# Altium project Power Supply.PrjPcb (part 3 of 3)
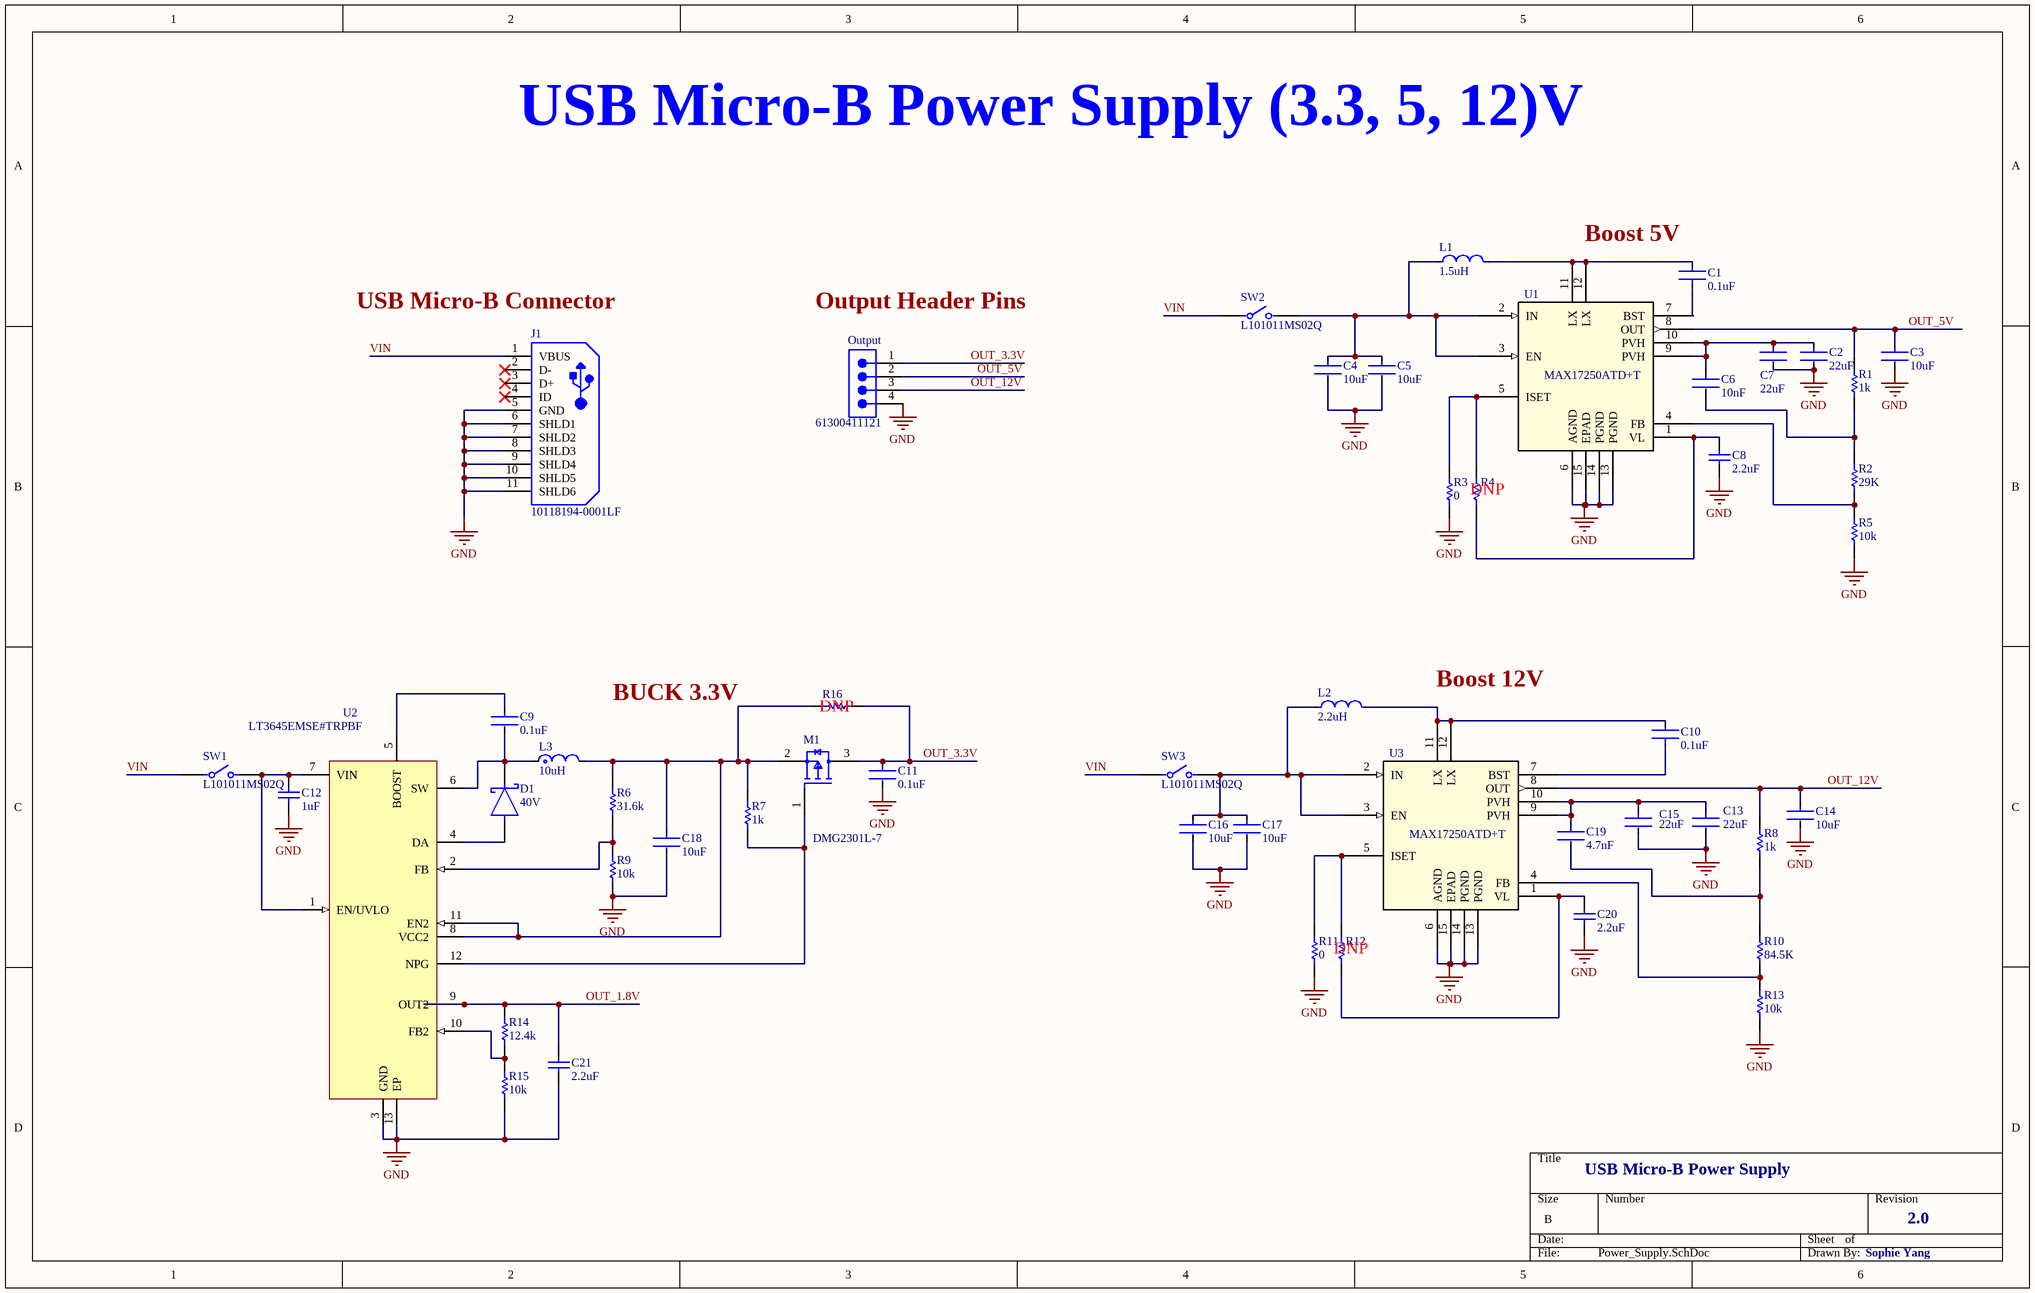
[diagram p2: Power_Supply.SchDoc]

## Sheet Power_Supply.SchDoc (continued)

### Library data of the parts (continued)
R10 = CRCW080584K5FKEA: RES SMD 84.5K OHM 1% 1/8W 0805; Manufacturer: Vishay; Power: 125mW; Rated Temperature: 70°C; Value: 84.5kR; Working Voltage: 150V; Temperature Coefficient (ppm/Cel): 100; Package Height: 0.45mm; Package Length: 2mm; Package Width: 1.25mm; Reference Standard: AEC-Q200; Supplier: Digikey; Supplier Part Number: 541-84.5KCCT-ND; Manufacturer Part Number: CRCW080584K5FKEA; RoHS: Yes; Category: Chip SMD Resistors; Stock: 69341; Pricing: 1=0.1, 10=0.041, 100=0.0212, 1000=0.01254, 2500=0.01059 (USD); Mounting Technology: Surface Mount; Pins: 2; Package Shape: Rectangular; Case/Package: 0805; Terminal Finish: Nickel; Min Operating Temperature: -55°C; Max Operating Temperature: 155°C; Tolerance: 1%; JESD-609 Code: e3; Resistor Type: FIXED RESISTOR; Construction: Chip; Packaging: Tape and Reel; Technology: METAL GLAZE/THICK FILM; Termination: Wraparound; Reach SVHC Compliant: Yes; RoHS Compliant: Yes; ComponentLink1URL: https://datasheet.ciiva.com:443/pdfs/VipMasterIC/IC/VISH/VISH-S-A0007266705/VISH-S-A0007266705-1.pdf?src-supplier=IHS+Markit; ComponentLink1Description: https://datasheet.ciiva.com:443/pdfs/VipMasterIC/IC/VISH/VISH-S-A0007266705/VISH-S-A0007266705-1.pdf?src-supplier=IHS+Markit; ComponentLink2URL: https://datasheet.ciiva.com/7816/1533075-7816217.pdf?src-supplier=Element14; ComponentLink2Description: https://datasheet.ciiva.com/7816/1533075-7816217.pdf?src-supplier=Element14; ComponentLink3URL: https://datasheet.ciiva.com/2495/dcrcwe3-2495959.pdf?src-supplier=Digikey; ComponentLink3Description: https://datasheet.ciiva.com/2495/dcrcwe3-2495959.pdf?src-supplier=Digikey; ComponentLink4URL: https://datasheet.ciiva.com/2495/dcrcwe3-2495960.pdf?src-supplier=Digikey; ComponentLink4Description: https://datasheet.ciiva.com/2495/dcrcwe3-2495960.pdf?src-supplier=Digikey; ComponentLink5URL: https://datasheet.ciiva.com/2495/dcrcwe3-2495961.pdf?src-supplier=Digikey; ComponentLink5Description: https://datasheet.ciiva.com/2495/dcrcwe3-2495961.pdf?src-supplier=Digikey; ComponentLink6URL: https://datasheet.ciiva.com/8986/dcrcwe3-8986394.pdf?src-supplier=Avnet; ComponentLink6Description: https://datasheet.ciiva.com/8986/dcrcwe3-8986394.pdf?src-supplier=Avnet; ComponentLink7URL: https://datasheet.ciiva.com/5542/dcrcwe3-109170-5542574.pdf?src-supplier=Mouser; ComponentLink7Description: https://datasheet.ciiva.com/5542/dcrcwe3-109170-5542574.pdf?src-supplier=Mouser; ComponentLink8URL: https://datasheet.ciiva.com/22675/1847332-22675911.pdf?src-supplier=Element14; ComponentLink8Description: https://datasheet.ciiva.com/22675/1847332-22675911.pdf?src-supplier=Element14; ComponentLink9URL: https://datasheet.ciiva.com/16498/dcrcwe3-16498263.pdf?src-supplier=Future+Electronics; ComponentLink9Description: https://datasheet.ciiva.com/16498/dcrcwe3-16498263.pdf?src-supplier=Future+Electronics; LCSC Part Number: C3914761; Supplier 1: Digikey; Supplier Part Number 1: 541-84.5KCCT-ND
R14 = CRCW080512K4FKEA: RES SMD 12.4K OHM 1% 1/8W 0805; Manufacturer: Vishay; Power: 125mW; Rated Temperature: 70°C; Value: 12.4kR; Working Voltage: 150V; Temperature Coefficient (ppm/Cel): 100; Package Height: 0.45mm; Package Length: 2mm; Package Width: 1.25mm; Reference Standard: AEC-Q200; Supplier: Digikey; Supplier Part Number: 541-12.4KCCT-ND; Manufacturer Part Number: CRCW080512K4FKEA; RoHS: Yes; Category: Chip SMD Resistors; Stock: 11364; Pricing: 1=0.1, 10=0.041, 100=0.0212, 1000=0.01165, 2500=0.01059 (USD); Mounting Technology: Surface Mount; Pins: 2; Package Shape: Rectangular; Case/Package: 0805; Terminal Finish: Nickel; Min Operating Temperature: -55°C; Max Operating Temperature: 155°C; Tolerance: 1%; JESD-609 Code: e3; Resistor Type: FIXED RESISTOR; Construction: Chip; Packaging: Tape and Reel; Technology: METAL GLAZE/THICK FILM; Termination: Wraparound; Reach SVHC Compliant: Yes; RoHS Compliant: Yes; ComponentLink1URL: https://datasheet.ciiva.com:443/pdfs/VipMasterIC/IC/VISH/VISH-S-A0007266705/VISH-S-A0007266705-1.pdf?src-supplier=IHS+Markit; ComponentLink1Description: https://datasheet.ciiva.com:443/pdfs/VipMasterIC/IC/VISH/VISH-S-A0007266705/VISH-S-A0007266705-1.pdf?src-supplier=IHS+Markit; ComponentLink2URL: https://datasheet.ciiva.com/11811/0900766b80d98b26-11811262.pdf?src-supplier=Rs; ComponentLink2Description: https://datasheet.ciiva.com/11811/0900766b80d98b26-11811262.pdf?src-supplier=Rs; ComponentLink3URL: https://datasheet.ciiva.com/8337/dcrcwe3-8337545.pdf?src-supplier=Avnet; ComponentLink3Description: https://datasheet.ciiva.com/8337/dcrcwe3-8337545.pdf?src-supplier=Avnet; ComponentLink4URL: https://datasheet.ciiva.com/3258/dcrcwe3-3258086.pdf?src-supplier=Avnet; ComponentLink4Description: https://datasheet.ciiva.com/3258/dcrcwe3-3258086.pdf?src-supplier=Avnet; ComponentLink5URL: https://datasheet.ciiva.com/7663/1697337-7663925.pdf?src-supplier=Element14; ComponentLink5Description: https://datasheet.ciiva.com/7663/1697337-7663925.pdf?src-supplier=Element14; ComponentLink6URL: https://datasheet.ciiva.com/2495/dcrcwe3-2495563.pdf?src-supplier=Digikey; ComponentLink6Description: https://datasheet.ciiva.com/2495/dcrcwe3-2495563.pdf?src-supplier=Digikey; ComponentLink7URL: https://datasheet.ciiva.com/2495/dcrcwe3-2495564.pdf?src-supplier=Digikey; ComponentLink7Description: https://datasheet.ciiva.com/2495/dcrcwe3-2495564.pdf?src-supplier=Digikey; ComponentLink8URL: https://datasheet.ciiva.com/2495/dcrcwe3-2495565.pdf?src-supplier=Digikey; ComponentLink8Description: https://datasheet.ciiva.com/2495/dcrcwe3-2495565.pdf?src-supplier=Digikey; ComponentLink9URL: https://datasheet.ciiva.com/5544/dcrcwe3-109170-5544184.pdf?src-supplier=Mouser; ComponentLink9Description: https://datasheet.ciiva.com/5544/dcrcwe3-109170-5544184.pdf?src-supplier=Mouser; ComponentLink10URL: https://datasheet.ciiva.com/16784/70201119-16784493.pdf?src-supplier=Allied+Electronics; ComponentLink10Description: https://datasheet.ciiva.com/16784/70201119-16784493.pdf?src-supplier=Allied+Electronics; ComponentLink11URL: https://datasheet.ciiva.com/7664/1697337-7664029.pdf?src-supplier=Element14; ComponentLink11Description: https://datasheet.ciiva.com/7664/1697337-7664029.pdf?src-supplier=Element14; ComponentLink12URL: https://datasheet.ciiva.com/16391/dcrcwe3-16391354.pdf?src-supplier=Future+Electronics; ComponentLink12Description: https://datasheet.ciiva.com/16391/dcrcwe3-16391354.pdf?src-supplier=Future+Electronics; Supplier 1: Digikey; Supplier Part Number 1: 541-12.4KCCT-ND
SW1-SW3 = CMP-10038-000020-1: SWITCH SLIDE SPST 4A 125V; Actuator Length: 5.08mm; Actuator Type: Standard; Contact Current Rating: 2A; Electrical Life: 10000Cycles; Switch Function: On-Off; Voltage Rating (DC): 28V; Actuator Color: Black; Actuator Material: Nylon; Switch Travel: 3.81mm; Max Voltage Rating (AC): 250V; Max Current Rating: 4A; Contact Plating: Silver; Throw Configuration: SPST; Depth: 10.8mm; Package Quantity: 1; Length: 19.1mm; Current Rating: 4A; Max Operating Temperature: 65°C; Orientation: Straight; Radiation Hardening: No; Termination: PC Pins; Max Voltage Rating (DC): 125V; Series: L; Min Operating Temperature: -30°C; Contact Material: Copper; Lead Free: Lead Free; Mount: Through Hole; RoHS Compliant: Yes; Voltage Rating (AC): 125V; Packaging: Bulk; Housing Material: Nylon; Supplier 1: Mouser; Supplier Part Number 1: 611-L101011MS02Q
U1 U3 = MAX17250ATD+T: IC REG BOOST ADJ 14TDFN; Manufacturer: Maxim; Output Type: Adjustable; Output Configuration: Positive; Number of Outputs: 1; Min Input Voltage: 2.7V; Max Supply Voltage: 18V; Min Output Voltage: 3V; Switching Frequency: 1MHz; Synchronous Rectifier: Yes; Supplier: Digikey; Supplier Part Number: 175-MAX17250ATD+TCT-ND; Manufacturer Part Number: MAX17250ATD+T; RoHS: No; Category: Voltage Regulators - Switching; Stock: 6120; Pricing: 1=6.24, 10=4.794, 25=4.4312, 100=4.033, 250=3.843, 500=3.72852, 1000=3.63428 (USD); Mounting Technology: Surface Mount; Min Operating Temperature: -40°C; Max Operating Temperature: 125°C; Topology: Boost; Series: -; Packaging: Tape and Reel; Max Output Voltage: 18V; ComponentLink1URL: https://datasheets.maximintegrated.com/en/ds/MAX17250.pdf?src-supplier=Digikey; ComponentLink1Description: https://datasheets.maximintegrated.com/en/ds/MAX17250.pdf?src-supplier=Digikey; Parameter 1: *; Parameter 2: *; LCSC Part Number: C2072526
  U1: Supplier 1: Digikey; Supplier Part Number 1: 175-MAX17250ATD+TCT-ND
U2 = LT3645EMSE#TRPBF: IC REG DL BUCK/LNR 750KHZ 12MSOP; Manufacturer: Analog Devices / Linear Technology; Package Body Material: Plastic; Throw Configuration: SWITCHING REGULATOR; Control Mode: CURRENT-MODE; Max Supply Voltage: 36V; Min Input Voltage: 3.6V; Nominal Supply Voltage: 12V; Channels: 1; Max Output current: 1.25A; Switcher Configuration: BUCK; Frequency: 825kHz; Qualification Status: Not Qualified; Supplier: Digikey; Supplier Part Number: 505-LT3645EMSE#TRPBFCT-ND; Manufacturer Part Number: LT3645EMSE#TRPBF; RoHS: Yes; Category: Voltage Regulators - Switching; Stock: 1540; Pricing: 1=8.28, 10=5.556, 25=4.846, 100=4.0433, 250=3.6492, 500=3.55 (USD); Case/Package: HTSSOP; Pins: 12; Package Shape: Rectangular; Terminal Finish: Tin; Min Operating Temperature: 0°C; Max Operating Temperature: 125°C; JESD-609 Code: e3; Moisture Sensitivity Level: 1; Package Style: SMALL OUTLINE, HEAT SINK/SLUG, THIN PROFILE, SHRINK PITCHMeter; Surface Mount: Yes; Terminal Form: Gull Wing; Terminal Position: DUAL; Length: 4.039mm; Width: 3mm; Height - Seated (Max): 1.1mm; Terminal Pitch: 0.65mm; Temperature Grade: OTHER; Reach SVHC Compliant: Yes; RoHS Compliant: Yes; ComponentLink1URL: https://datasheet.ciiva.com:443/pdfs/VipMasterIC/IC/LITC/LITCS11322/LITCS11322-1.pdf?src-supplier=IHS+Markit; ComponentLink1Description: https://datasheet.ciiva.com:443/pdfs/VipMasterIC/IC/LITC/LITCS11322/LITCS11322-1.pdf?src-supplier=IHS+Markit; ComponentLink2URL: https://datasheet.ciiva.com/2076/39814-2076559.pdf?src-supplier=Digikey; ComponentLink2Description: https://datasheet.ciiva.com/2076/39814-2076559.pdf?src-supplier=Digikey; Supplier 1: Digikey; Supplier Part Number 1: 505-LT3645EMSE#TRPBFCT-ND

## Assembly variants
DNP: not fitted R4 R12 R16